# Altium project CRYO_ASIC_test_CTRL_panel.PrjPcb
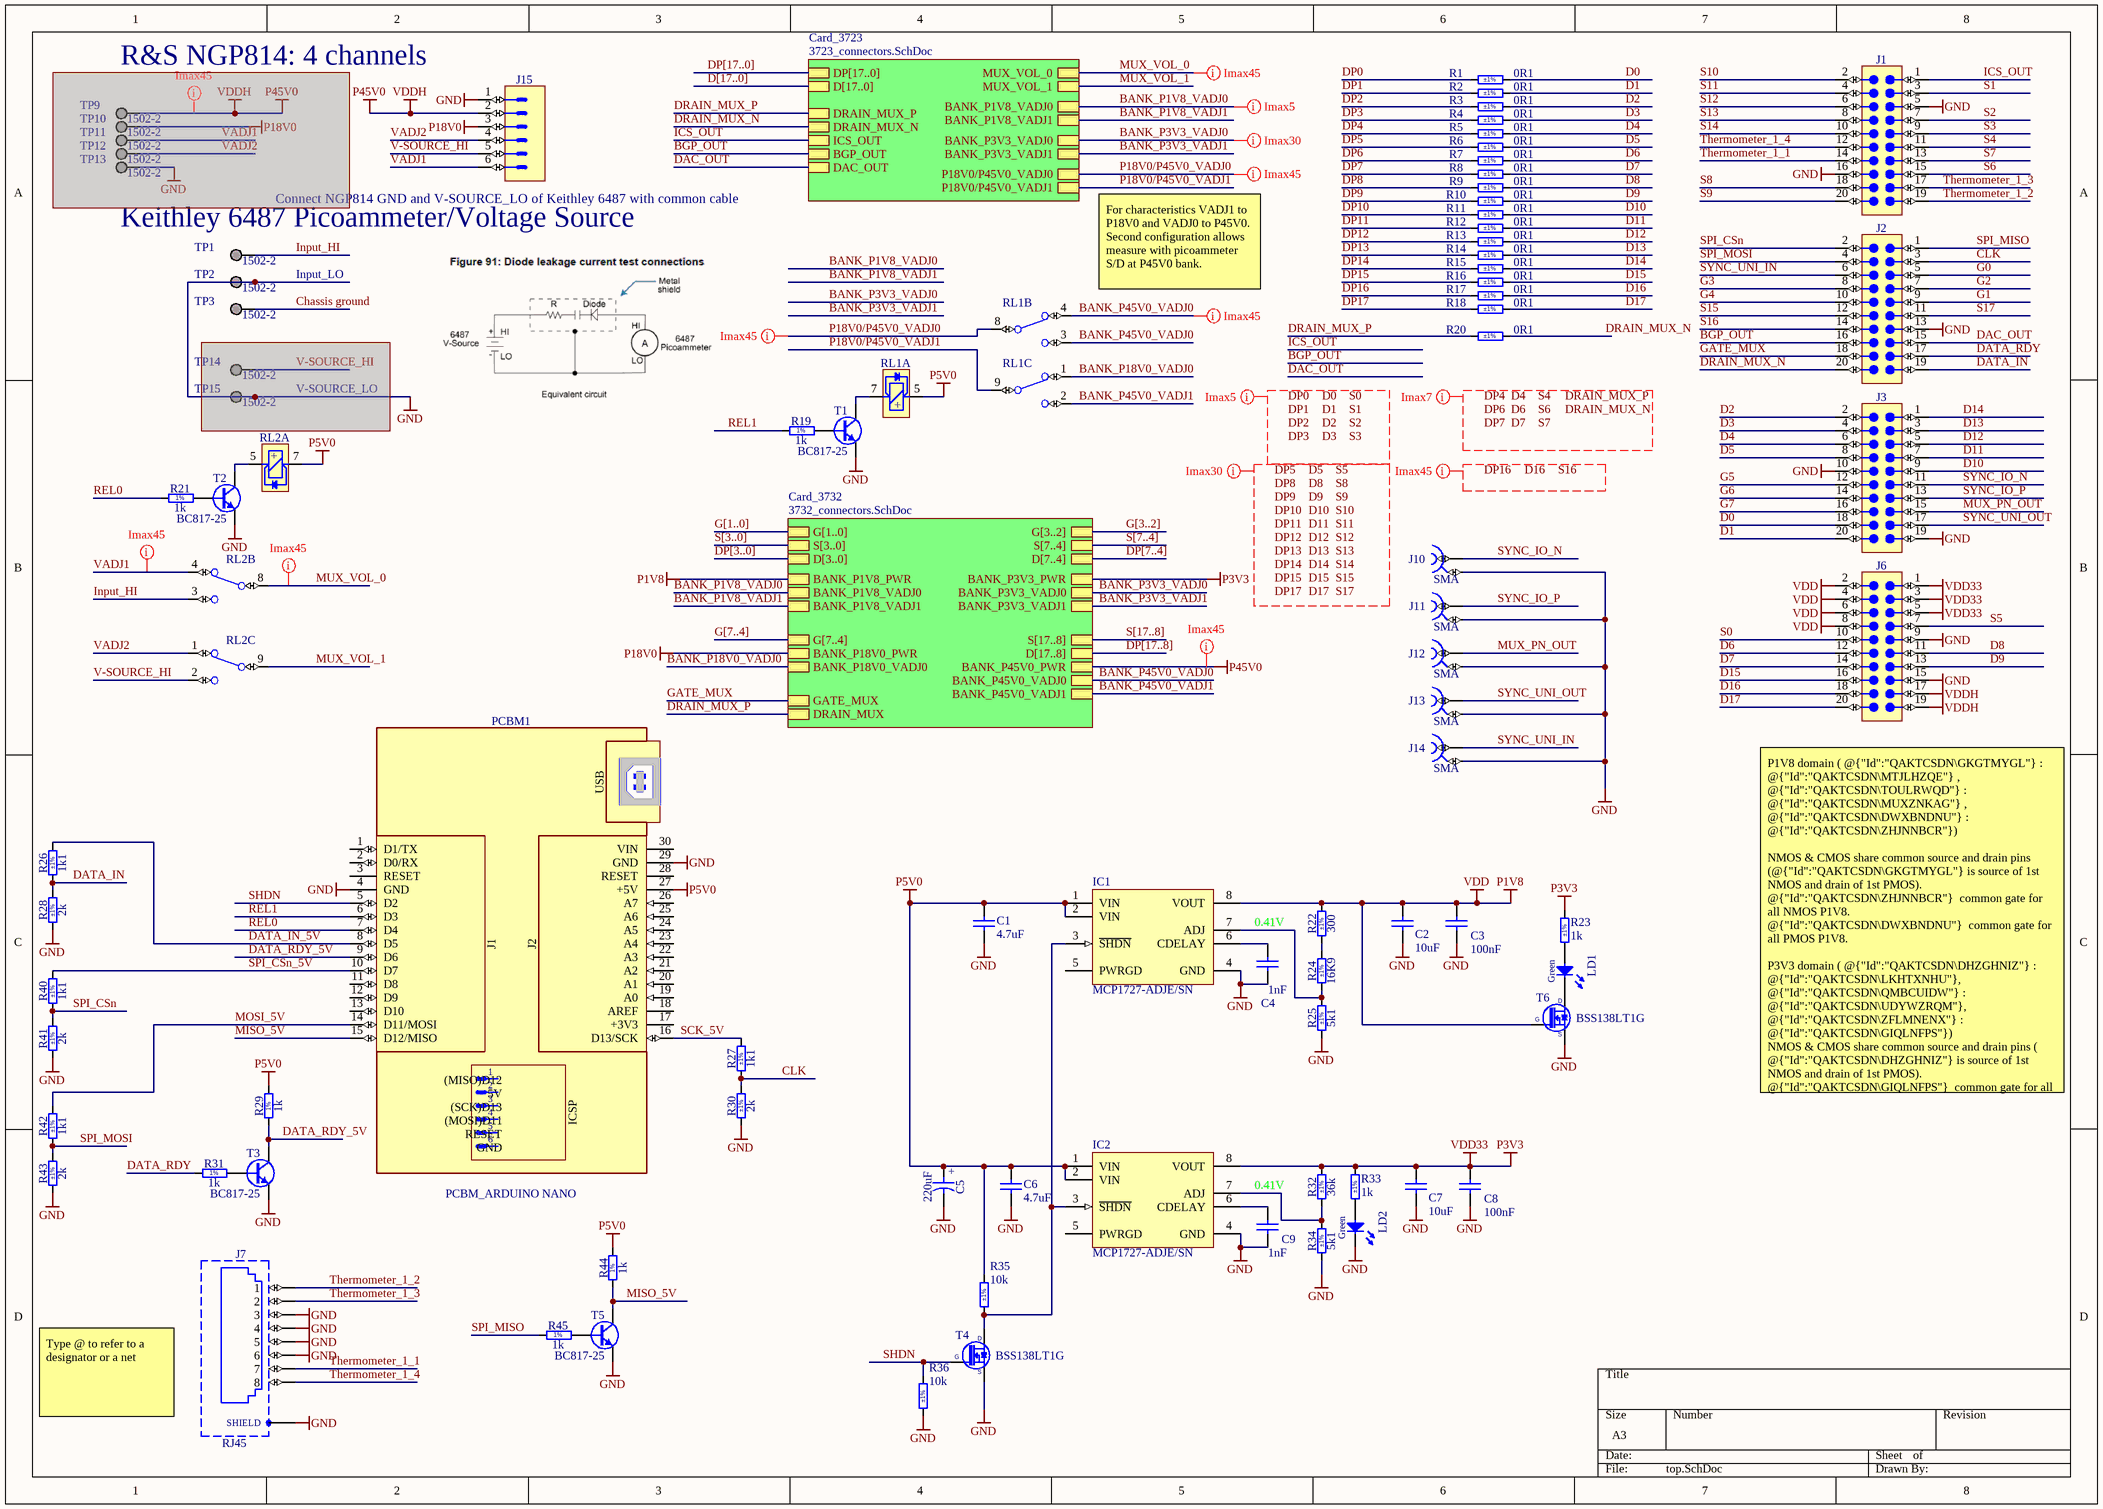
[diagram p0: top.SchDoc]
3 sheets, 97 parts. Net scope: hierarchical (ports join the sheet entries above them; power ports are global).
Board file: ctrl_panel.PcbDoc
Sheets:
  top.SchDoc
    Card_3732 = 3732_connectors.SchDoc
    Card_3723 = 3723_connectors.SchDoc

## Sheet top.SchDoc
size A3; SheetNumber: 1; SheetTotal: 3

### Parts
C1  4.7uF  [CAPC1005X55N]
C2  10uF  [CAPC1608X80N]
C3  100nF  [CAPC1005X55N]
C4  1nF  [CAPC1005X55N]
C5  220uF  [CAPMP7343X430N]
C6  4.7uF  [CAPC1005X55N]
C7  10uF  [CAPC1608X80N]
C8  100nF  [CAPC1005X55N]
C9  1nF  [CAPC1005X55N]
IC1  MCP1727-ADJE/SN  [SO-8]
IC2  MCP1727-ADJE/SN  [SO-8]
J1  Header 20  [3M_45220-600230]  (value not drawn)
J2  Header 20  [3M_45220-600230]  (value not drawn)
J3  Header 20  [3M_45220-600230]  (value not drawn)
J6  Header 20  [3M_45220-600230]  (value not drawn)
J7  RJ45  [TYCO_6368150-1]
J10  SMA  [SAMTEC_SMA-J-P-H-ST-TH1]
J11  SMA  [SAMTEC_SMA-J-P-H-ST-TH1]
J12  SMA  [SAMTEC_SMA-J-P-H-ST-TH1]
J13  SMA  [SAMTEC_SMA-J-P-H-ST-TH1]
J14  SMA  [SAMTEC_SMA-J-P-H-ST-TH1]
J15  Mini-Fit Jr.™  [MOLEX_39-30-0060]  (value not drawn)
LD1  Green  [LED_KINGBRIGHT_KP-1608CGCK]
LD2  Green  [LED_KINGBRIGHT_KP-1608CGCK]
PCBM1  PCBM_ARDUINO NANO  [PCBM_ARDUINO NANO_a]
R1  0R1  Tolerance: ±1%  [RESC1608X55N]
R2  0R1  Tolerance: ±1%  [RESC1608X55N]
R3  0R1  Tolerance: ±1%  [RESC1608X55N]
R4  0R1  Tolerance: ±1%  [RESC1608X55N]
R5  0R1  Tolerance: ±1%  [RESC1608X55N]
R6  0R1  Tolerance: ±1%  [RESC1608X55N]
R7  0R1  Tolerance: ±1%  [RESC1608X55N]
R8  0R1  Tolerance: ±1%  [RESC1608X55N]
R9  0R1  Tolerance: ±1%  [RESC1608X55N]
R10  0R1  Tolerance: ±1%  [RESC1608X55N]
R11  0R1  Tolerance: ±1%  [RESC1608X55N]
R12  0R1  Tolerance: ±1%  [RESC1608X55N]
R13  0R1  Tolerance: ±1%  [RESC1608X55N]
R14  0R1  Tolerance: ±1%  [RESC1608X55N]
R15  0R1  Tolerance: ±1%  [RESC1608X55N]
R16  0R1  Tolerance: ±1%  [RESC1608X55N]
R17  0R1  Tolerance: ±1%  [RESC1608X55N]
R18  0R1  Tolerance: ±1%  [RESC1608X55N]
R19  1k  [RESC1005X40N]
R20  0R1  Tolerance: ±1%  [RESC1608X55N]
R21  1k  [RESC1005X40N]
R22  300  Tolerance: ±1%  [RESC1005X40N]
R23  1k  Tolerance: ±1%  [RESC1005X40N]
R24  16K9  Tolerance: ±1%  [RESC1005X40N]
R25  5k1  Tolerance: ±1%  [RESC1005X40N]
R26  1k1  Tolerance: ±1%  [RESC1005X40N]
R27  1k1  Tolerance: ±1%  [RESC1005X40N]
R28  2k  Tolerance: ±1%  [RESC1005X40N]
R29  1k  [RESC1005X40N]
R30  2k  Tolerance: ±1%  [RESC1005X40N]
R31  1k  [RESC1005X40N]
R32  36k  Tolerance: ±1%  [RESC1005X40N]
R33  1k  Tolerance: ±1%  [RESC1005X40N]
R34  5k1  Tolerance: ±1%  [RESC1005X40N]
R35  10k  Tolerance: ±1%  [RESC1005X40N]
R36  10k  Tolerance: ±1%  [RESC1005X40N]
R40  1k1  Tolerance: ±1%  [RESC1005X40N]
R41  2k  Tolerance: ±1%  [RESC1005X40N]
R42  1k1  Tolerance: ±1%  [RESC1005X40N]
R43  2k  Tolerance: ±1%  [RESC1005X40N]
R44  1k  [RESC1005X40N]
R45  1k  [RESC1005X40N]
RL1  REL_PICKERING_107-2-C-5/3D  [REL_PICKERING_107-2-C]  (value not drawn)  (parts A,B,C of 3)
RL2  REL_PICKERING_107-2-C-5/3D  [REL_PICKERING_107-2-C]  (value not drawn)  (parts A,B,C of 3)
T1  BC817-25  [SOT95P230X110-3N]
T2  BC817-25  [SOT95P230X110-3N]
T3  BC817-25  [SOT95P230X110-3N]
T4  BSS138LT1G  [SOT95P240X110-3N]
T5  BC817-25  [SOT95P230X110-3N]
T6  BSS138LT1G  [SOT95P240X110-3N]
TP1  1502-2  [KSTN-1502-2]
TP2  1502-2  [KSTN-1502-2]
TP3  1502-2  [KSTN-1502-2]
TP9  1502-2  [KSTN-1502-2]  (masked out: inside a compile mask, not in the netlist)
TP10  1502-2  [KSTN-1502-2]  (masked out: inside a compile mask, not in the netlist)
TP11  1502-2  [KSTN-1502-2]  (masked out: inside a compile mask, not in the netlist)
TP12  1502-2  [KSTN-1502-2]  (masked out: inside a compile mask, not in the netlist)
TP13  1502-2  [KSTN-1502-2]  (masked out: inside a compile mask, not in the netlist)
TP14  1502-2  [KSTN-1502-2]  (masked out: inside a compile mask, not in the netlist)
TP15  1502-2  [KSTN-1502-2]  (masked out: inside a compile mask, not in the netlist)

### Sub-sheets
Card_3723 = 3723_connectors.SchDoc: D[17..0], DP[17..0], DRAIN_MUX_P, DRAIN_MUX_N, ICS_OUT, BGP_OUT, DAC_OUT, MUX_VOL_0, MUX_VOL_1, BANK_P1V8_VADJ0, BANK_P1V8_VADJ1, BANK_P3V3_VADJ0, BANK_P3V3_VADJ1, P18V0/P45V0_VADJ0, P18V0/P45V0_VADJ1
Card_3732 = 3732_connectors.SchDoc: G[1..0], S[3..0], D[3..0], BANK_P1V8_PWR, BANK_P1V8_VADJ0, BANK_P1V8_VADJ1, G[3..2], S[7..4], D[7..4], BANK_P3V3_PWR, BANK_P3V3_VADJ0, BANK_P3V3_VADJ1, G[7..4], BANK_P18V0_PWR, BANK_P18V0_VADJ0, S[17..8], D[17..8], BANK_P45V0_PWR, BANK_P45V0_VADJ0, GATE_MUX, DRAIN_MUX, BANK_P45V0_VADJ1

### Nets
GND: C1.1 C2.1 C3.1 C4.1 C5.2 C6.1 C7.1 C8.1 C9.1 IC1.4(GND) IC2.4(GND) J1.5 J1.16 J2.13 J3.10 J3.19 J6.9 J6.15 J7.3 J7.4 J7.5 J7.6 J7.SHIELD J10.2 J11.2 J12.2 J13.2 J14.2 J15.1 LD2.1(C) PCBM1.4(GND) PCBM1.29(GND) R25.1 R28.1 R30.1 R34.1 R36.2 R41.1 R43.1 T1.2(E) T2.2(E) T3.2(E) T4.2(S) T5.2(E) T6.2(S) TP2.1
P1V8: C2.2 C3.2 IC1.8(VOUT) J6.2 J6.4 J6.6 J6.8 R22.2 T6.1(G) ; sheet Card_3732/BANK_P1V8_PWR  [also labelled VDD]
P3V3: C7.2 C8.2 IC2.8(VOUT) J6.1 J6.3 J6.5 R23.2 R32.2 R33.2 ; sheet Card_3732/BANK_P3V3_PWR  [also labelled VDD33]
P5V0: C1.2 C5.1 C6.2 IC1.1(VIN) IC1.2(VIN) IC2.1(VIN) IC2.2(VIN) PCBM1.27(+5V) R29.2 R35.1 R44.2 RL1.5(COIL+) RL2.7(COIL-)
P18V0: J15.3 ; sheet Card_3732/BANK_P18V0_PWR
P45V0: J6.17 J6.19 J15.2 ; sheet Card_3732/BANK_P45V0_PWR  [also labelled VDDH]
BANK_P1V8_VADJ0: sheet Card_3732/BANK_P1V8_VADJ0, sheet Card_3723/BANK_P1V8_VADJ0
BANK_P1V8_VADJ1: sheet Card_3732/BANK_P1V8_VADJ1, sheet Card_3723/BANK_P1V8_VADJ1
BANK_P3V3_VADJ0: sheet Card_3732/BANK_P3V3_VADJ0, sheet Card_3723/BANK_P3V3_VADJ0
BANK_P3V3_VADJ1: sheet Card_3732/BANK_P3V3_VADJ1, sheet Card_3723/BANK_P3V3_VADJ1
BANK_P18V0_VADJ0: RL1.1(NC) ; sheet Card_3732/BANK_P18V0_VADJ0
BANK_P45V0_VADJ0: RL1.3(NO) RL1.4(NC) ; sheet Card_3732/BANK_P45V0_VADJ0
BANK_P45V0_VADJ1: RL1.2(NO) ; sheet Card_3732/BANK_P45V0_VADJ1
BGP_OUT: J2.16 ; sheet Card_3723/BGP_OUT
Chassis ground: TP3.1
CLK: J2.3 R27.1 R30.2
D0: J3.18 R1.2
D1: J3.20 R2.2
D2: J3.2 R3.2
D3: J3.4 R4.2
D4: J3.6 R5.2
D5: J3.8 R6.2
D6: J6.12 R7.2
D7: J6.14 R8.2
D8: J6.11 R9.2
D9: J6.13 R10.2
D10: J3.9 R11.2
D11: J3.7 R12.2
D12: J3.5 R13.2
D13: J3.3 R14.2
D14: J3.1 R15.2
D15: J6.16 R16.2
D16: J6.18 R17.2
D17: J6.20 R18.2
DAC_OUT: J2.15 ; sheet Card_3723/DAC_OUT
DATA_IN: J2.19 R26.1 R28.2
DATA_IN_5V: PCBM1.8(D5) R26.2
DATA_RDY: J2.17 R31.1
DATA_RDY_5V: PCBM1.9(D6) R29.1 T3.3(C)
DP0: R1.1
DP1: R2.1
DP2: R3.1
DP3: R4.1
DP4: R5.1
DP5: R6.1
DP6: R7.1
DP7: R8.1
DP8: R9.1
DP9: R10.1
DP10: R11.1
DP11: R12.1
DP12: R13.1
DP13: R14.1
DP14: R15.1
DP15: R16.1
DP16: R17.1
DP17: R18.1
DRAIN_MUX_N: J2.20 R20.2 ; sheet Card_3723/DRAIN_MUX_N
DRAIN_MUX_P: R20.1 ; sheet Card_3732/DRAIN_MUX, sheet Card_3723/DRAIN_MUX_P
G0: J2.5
G1: J2.9
G2: J2.7
G3: J2.8
G4: J2.10
G5: J3.12
G6: J3.14
G7: J3.16
GATE_MUX: J2.18 ; sheet Card_3732/GATE_MUX
ICS_OUT: J1.1 ; sheet Card_3723/ICS_OUT
Input_HI: RL2.3(NO) TP1.1
MISO_5V: PCBM1.15(D12/MISO) R44.1 T5.3(C)
MOSI_5V: PCBM1.14(D11/MOSI) R42.2
MUX_PN_OUT: J3.15 J12.1
MUX_VOL_0: RL2.8(C) ; sheet Card_3723/MUX_VOL_0
MUX_VOL_1: RL2.9(C) ; sheet Card_3723/MUX_VOL_1
P18V0/P45V0_VADJ0: RL1.8(C) ; sheet Card_3723/P18V0/P45V0_VADJ0
P18V0/P45V0_VADJ1: RL1.9(C) ; sheet Card_3723/P18V0/P45V0_VADJ1
REL0: PCBM1.7(D4) R21.1
REL1: PCBM1.6(D3) R19.1
S0: J6.10
S1: J1.3
S2: J1.7
S3: J1.9
S4: J1.11
S5: J6.7
S6: J1.15
S7: J1.13
S8: J1.18
S9: J1.20
S10: J1.2
S11: J1.4
S12: J1.6
S13: J1.8
S14: J1.10
S15: J2.12
S16: J2.14
S17: J2.11
SCK_5V: PCBM1.16(D13/SCK) R27.2
SHDN: PCBM1.5(D2) R36.1 T4.1(G)
SPI_CSn: J2.2 R40.1 R41.2
SPI_CSn_5V: PCBM1.10(D7) R40.2
SPI_MISO: J2.1 R45.1
SPI_MOSI: J2.4 R42.1 R43.2
SYNC_IO_N: J3.11 J10.1
SYNC_IO_P: J3.13 J11.1
SYNC_UNI_IN: J2.6 J14.1
SYNC_UNI_OUT: J3.17 J13.1
Thermometer_1_1: J1.14 J7.7
Thermometer_1_2: J1.19 J7.1
Thermometer_1_3: J1.17 J7.2
Thermometer_1_4: J1.12 J7.8
V-SOURCE_HI: J15.5 RL2.2(NO)
VADJ1: J15.6 RL2.4(NC)
VADJ2: J15.4 RL2.1(NC)
NetC4_2: C4.2 IC1.6(CDELAY)
NetC9_2: C9.2 IC2.6(CDELAY)
NetIC1_3: IC1.3(~{SHDN}) IC2.3(~{SHDN}) R35.2 T4.3(D)
NetIC1_7: IC1.7(ADJ) R24.1 R25.2
NetIC2_7: IC2.7(ADJ) R32.1 R34.2
NetLD1_1: LD1.1(C) T6.3(D)
NetLD1_2: LD1.2(A) R23.1
NetLD2_2: LD2.2(A) R33.1
NetR19_2: R19.2 T1.1(B)
NetR21_2: R21.2 T2.1(B)
NetR22_1: R22.1 R24.2
NetR31_2: R31.2 T3.1(B)
NetR45_2: R45.2 T5.1(B)
NetRL1_7: RL1.7(COIL-) T1.3(C)
NetRL2_5: RL2.5(COIL+) T2.3(C)

Not connected (* = marked no-connect by the designer): IC1 5(PWRGD); IC2 5(PWRGD); PCBM1 1(D1/TX) 2(D0/RX) 3(RESET) 11(D8) 12(D9) 13(D10) 17(+3V3) 18(AREF) 19(A0) 20(A1) 21(A2) 22(A3) 23(A4) 24(A5) 25(A6) 26(A7) 28(RESET) 30(VIN)

### Buses and harness runs
bus D[17..0] = sheet Card_3723/D[17..0]
bus DP[3..0] = sheet Card_3732/D[3..0]
bus DP[7..4] = sheet Card_3732/D[7..4]
bus DP[17..0] = sheet Card_3723/DP[17..0]
bus DP[17..8] = sheet Card_3732/D[17..8]
bus G[1..0] = sheet Card_3732/G[1..0]
bus G[3..2] = sheet Card_3732/G[3..2]
bus G[7..4] = sheet Card_3732/G[7..4]
bus S[3..0] = sheet Card_3732/S[3..0]
bus S[7..4] = sheet Card_3732/S[7..4]
bus S[17..8] = sheet Card_3732/S[17..8]

### Layout directives
net class Imax5: BANK_P1V8_VADJ0, D0, D1, D2, D3, DP0, DP1, DP2, DP3, S0, S1, S2, S3
net class Imax7: D4, D6, D7, DP4, DP6, DP7, DRAIN_MUX_N, DRAIN_MUX_P, S4, S6, S7
net class Imax30: BANK_P3V3_VADJ0, D5, D8, D9, D10, D11, D12, D13, D14, D15, D17, DP5, DP8, DP9, DP10, DP11, DP12, DP13, DP14, DP15, DP17, S5, S8, S9, S10, S11, S12, S13, S14, S15, S17
net class Imax45: (no net found under the mark), BANK_P45V0_VADJ0, D16, DP16, MUX_VOL_0, P18V0/P45V0_VADJ0, P45V0, S16, VADJ1

### Notes on the sheet
- R&S NGP814: 4 channels
- (near TP1) Keithley 6487 Picoammeter/Voltage Source
- (near J15) Connect NGP814 GND and V-SOURCE_LO of Keithley 6487 with common cable
- Input_LO
- For characteristics VADJ1 to P18V0 and VADJ0 to P45V0.
  Second configuration allows measure with picoammeter S/D at P45V0 bank.
- V-SOURCE_LO
- 0.41V
- (near J6) P1V8 domain ( @{"Id":"QAKTCSDN\GKGTMYGL"} : @{"Id":"QAKTCSDN\MTJLHZQE"} , @{"Id":"QAKTCSDN\TOULRWQD"} : @{"Id":"QAKTCSDN\MUXZNKAG"} , @{"Id":"QAKTCSDN\DWXBNDNU"} : @{"Id":"QAKTCSDN\ZHJNNBCR"})
  NMOS & CMOS share common source and drain pins (@{"Id":"QAKTCSDN\GKGTMYGL"} is source of 1st NMOS and drain of 1st PMOS).
  @{"Id":"QAKTCSDN\ZHJNNBCR"}  common gate for all NMOS P1V8.
  @{"Id":"QAKTCSDN\DWXBNDNU"}  common gate for all PMOS P1V8.
  P3V3 domain ( @{"Id":"QAKTCSDN\DHZGHNIZ"} : @{"Id":"QAKTCSDN\LKHTXNHU"}, @{"Id":"QAKTCSDN\QMBCUIDW"} : @{"Id":"QAKTCSDN\UDYWZRQM"}, @{"Id":"QAKTCSDN\ZFLMNENX"} : @{"Id":"QAKTCSDN\GIQLNFPS"})
  NMOS & CMOS share common source and drain pins ( @{"Id":"QAKTCSDN\DHZGHNIZ"} is source of 1st NMOS and drain of 1st PMOS).
  @{"Id":"QAKTCSDN\GIQLNFPS"}  common gate for all NMOS P3V3.
  @{"Id":"QAKTCSDN\ZFLMNENX"}  common gate for all PMOS P1V8.
  P18V0 domain ( @{"Id":"QAKTCSDN\TCQKZZJW"} : @{"Id":"QAKTCSDN\IFVMLPFB"})
  Gates for CMOS in P45V0 domain.
  @{"Id":"QAKTCSDN\TCQKZZJW"}  Gate for first 5 NMOS
  @{"Id":"QAKTCSDN\BTYXEQQY"}  Gate for second 5 NMOS
  @{"Id":"QAKTCSDN\BTVZBPLE"}  Gate for first 5 PMOS
  @{"Id":"QAKTCSDN\IFVMLPFB"}  Gate for second 5 PMOS
  P45V0 domain ( @{"Id":"QAKTCSDN\KKAFSXUZ"} : @{"Id":"QAKTCSDN\VMRQOTMS"}, @{"Id":"QAKTCSDN\EVYYKNRE"} : @{"Id":"QAKTCSDN\AUFCYRPE"})
  Sources and drains for cmos:
  8-12: NMOS, 2 transistors per pin (different gate)
  13-17: PMOS, 2 transistors per pin (different gate)
- Type @ to refer to a designator or a net
- Labels drawn without touching a wire or pin: D0, D1, D2, D3, D4, D5, D6, D7, D8, D9, D10, D11, D12, D13, D14, D15, D16, D17, DP0, DP1, DP2, DP3, DP4, DP5, DP6, DP7, DP8, DP9, DP10, DP11, DP12, DP13, DP14, DP15, DP16, DP17, DRAIN_MUX_N, DRAIN_MUX_P, S0, S1, S2, S3, S4, S5, S6, S7, S8, S9, S10, S11, S12, S13, S14, S15, S16, S17
- (in symbol CTE7343-43_220UF_16V_10%) +
- (in symbol PCBM_ARDUINO NANO_a) USB; J1; J2; (MISO)D12; 5V; (SCK)D13; ICSP; (MOSI)D11
- (in symbol R0402_1K_1%_0.0625W_100PPM) 1%
- (in symbol REL_PICKERING_107-2-C-5/3D, part A) +

### Library data of the parts
C1 C6 = CC0402_4.7UF_10V_10%_X5R: Non-polarised capacitor; Part Description: SMD Multilayer Chip Ceramic Capacitor; Manufacturer: GENERIC; Manufacturer1 Part Number: C1005X5R1A475K050; Voltage: 10V; TC: X5R; Tolerance: ±10%; Value: 4.7uF; Part Number: CC0402_4.7UF_10V_10%_X5R; Component Kind: Standard; Component Type: Standard; Pin Count: 2; Status: Preferred; Manufacturer Part Number: CC0402_4.7UF_10V_10%_X5R; Case: 0402; Mounted: Yes; Socket: No; SMD: Yes; Sense: No; Manufacturer1 Example: TDK; Manufacturer1 ComponentHeight: 0.65mm; HelpURL: \\cern.ch\dfs\Applications\Altium\Datasheets\CC0402_X5R_TDK_C.pdf; Author: CERN DEM BC; CreateDate: 10.01.2020; LatestRevisionDate: 10.01.2020
C2 C7 = CC0603_10UF_10V_10%_X5R: Non-polarised capacitor; Part Description: SMD Multilayer Chip Ceramic Capacitor; Manufacturer: GENERIC; Manufacturer1 Part Number: GRM188R61A106KE69D; Voltage: 10V; TC: X5R; Tolerance: ±10%; Value: 10uF; Part Number: CC0603_10UF_10V_10%_X5R; Component Kind: Standard; Component Type: Standard; Pin Count: 2; Status: None; Manufacturer Part Number: CC0603_10UF_10V_10%_X5R; Case: 0603; Mounted: Yes; Socket: No; SMD: Yes; Sense: No; Manufacturer1 Example: MURATA; Manufacturer1 ComponentHeight: 0.8mm; HelpURL: \\cern.ch\dfs\Applications\Altium\Datasheets\CC0603_MURATA_GRM188R61A106KE69D.pdf; Author: CERN DEM JLC; CreateDate: 31.01.2017; LatestRevisionDate: 31.01.2017
C3 C8 = CC0402_100NF_16V_10%_X5R: Non-polarised capacitor; Part Description: SMD Multilayer Chip Ceramic Capacitor; Manufacturer: GENERIC; Manufacturer1 Part Number: GRM155R61C104KA88D; Voltage: 16V; TC: X5R; Tolerance: ±10%; Value: 100nF; Part Number: CC0402_100NF_16V_10%_X5R; Component Kind: Standard; Component Type: Standard; Pin Count: 2; Status: None; Manufacturer Part Number: CC0402_100NF_16V_10%_X5R; Case: 0402; Mounted: Yes; Socket: No; SMD: Yes; Sense: No; Manufacturer1 Example: MURATA; Manufacturer1 ComponentHeight: 0.55mm; HelpURL: \\cern.ch\dfs\Applications\Altium\Datasheets\CC0402_X5R_MURATA_GRM.pdf; Author: CERN DEM JLC; CreateDate: 10.12.2013; LatestRevisionDate: 10.12.2013
C4 C9 = CC0402_1NF_50V_5%_C0G: Non-polarised capacitor; Part Description: SMD Multilayer Chip Ceramic Capacitor; Manufacturer: GENERIC; Manufacturer1 Part Number: C0402C102J5GACTU; Voltage: 50V; TC: C0G/NP0; Tolerance: ±5%; Value: 1nF; Part Number: CC0402_1NF_50V_5%_C0G; Component Kind: Standard; Component Type: Standard; Pin Count: 2; Status: Preferred; Manufacturer Part Number: CC0402_1NF_50V_5%_C0G; Case: 0402; Mounted: Yes; Socket: No; SMD: Yes; Sense: No; Manufacturer1 Example: KEMET; Manufacturer1 ComponentHeight: 0.55mm; HelpURL: \\cern.ch\dfs\Applications\Altium\Datasheets\CC0402_C0G_KEMET_(Commercial Grade).pdf; Author: CERN DEM BC; CreateDate: 02.09.2019; LatestRevisionDate: 02.09.2019
C5 = CTE7343-43_220UF_16V_10%: Polarised capacitor; Part Description: Solid Tantalum Chip Capacitor; Manufacturer: GENERIC; Manufacturer1 Part Number: TAJE227K016R; Voltage: 16V; Tolerance: ±10%; Part Number: CTE7343-43_220UF_16V_10%; Component Kind: Standard; Component Type: Standard; Pin Count: 2; Value: 220uF; Status: Preferred; Manufacturer Part Number: CTE7343-43_220UF_16V_10%; Case: E; Mounted: Yes; Socket: No; SMD: Yes; Sense: No; Manufacturer1 Example: AVX; Manufacturer1 ComponentHeight: 4.3mm; HelpURL: \\cern.ch\dfs\Applications\Altium\Datasheets\CTE_AVX_TAJ.pdf; Author: CERN DEM JLC; CreateDate: 03.12.2007; LatestRevisionDate: 03.12.2007
IC1 IC2 = MCP1727-ADJE/SN: 1.5A, Low Voltage, Low Quiescent Current LDO Regulator, 8-Pin SOIC 150mil, Extended Temperature; Value: MCP1726-ADJE/SN; Published: 29-Jan-2009; DatasheetVersion: revB, Feb-2007; PackageVersion: revAW, Oct-2008; PackageReference: SOIC-SN8; Publisher: Altium Limited; PackageDescription: 8-Lead Plastic Small Outline (SN) - Narrow, 3.90mm Body [SOIC]; Code_JEDEC: MS-012; Code_IPC: SOIC127P600-8; ComponentLink1Description: Manufacturer Link; ComponentLink1URL: http://www.microchip.com; ComponentLink2Description: Datasheet; ComponentLink2URL: http://ww1.microchip.com/downloads/en/DeviceDoc/21999b.pdf; ComponentLink3Description: Packaging Specification; ComponentLink3URL: http://ww1.microchip.com/downloads/en/PackagingSpec/00049AW.pdf
J1-J3 J6 = 3M_45220-600230: Connector 20 Male; Part Description: 20 Contacts - 1.27mm (0.050") Pitch - Shrouded Boardmount Vertical Header Without Latch/Ejectors, 452 Series; Manufacturer: 3M; PressFit: No; Part Number: 3M_45220-600230; Component Kind: Standard; Component Type: Standard; Pin Count: 20; Family: Header 20; Mounted: Yes; Socket: No; SMD: No; Sense: No; Status: None; Manufacturer Part Number: 45220-600230; ComponentHeight: 5.64mm; HelpURL: \\cern.ch\dfs\Applications\Altium\Datasheets\3M_45220-600230.pdf; Author: CERN DEM MR; CreateDate: 15.08.2019; LatestRevisionDate: 15.08.2019
J7 = TYCO_6368150-1: Connector RJ45 + Shield; Part Description: 1 Port, RJ45 Connector,  8 Positions, Shielded, Straight, Category 5; Manufacturer: TYCO ELECTRONICS; PressFit: No; Part Number: TYCO_6368150-1; Component Kind: Standard; Component Type: Standard; Pin Count: 10; Family: RJ45; Mounted: Yes; Socket: No; SMD: No; Sense: No; Status: None; Manufacturer Part Number: 6368150-1; ComponentHeight: 17.02mm; HelpURL: \\cern.ch\dfs\Applications\Altium\Datasheets\TYCO_6368150-1.pdf; Author: CERN DEM MR; CreateDate: 18.06.2019; LatestRevisionDate: 18.06.2019
J10-J14 = SAMTEC_SMA-J-P-H-ST-TH1: Part Description: 50 Ohm SMA Straight Through-hole PCB Jack; Manufacturer: SAMTEC; PressFit: No; Part Number: SAMTEC_SMA-J-P-H-ST-TH1; Component Kind: Standard; Component Type: Standard; Pin Count: 5; Family: SMA; Mounted: Yes; Socket: No; SMD: No; Sense: No; Status: None; Manufacturer Part Number: SMA-J-P-H-ST-TH1; ComponentHeight: 9.55mm; HelpURL: \\cern.ch\dfs\Applications\Altium\Datasheets\SAMTEC_SMA-J-P-H-ST-TH1.pdf; Author: CERN DEM BC; CreateDate: 11.01.2021; LatestRevisionDate: 11.01.2021
J15 = MOLEX_39-30-0060: Connector 6 Male; Part Description: 4.20mm (.165") Pitch Mini-Fit Jr. Header, Dual Row, Right Angle with Snap-in Plastic Peg PCB Lock, 6 Circuits; Manufacturer: MOLEX; PressFit: No; Part Number: MOLEX_39-30-0060; Component Kind: Standard; Component Type: Standard; Pin Count: 6; Family: Mini-Fit Jr.™; Mounted: Yes; Socket: No; SMD: No; Sense: No; Status: None; Manufacturer Part Number: 39-30-0060; ComponentHeight: 11.4mm; HelpURL: \\cern.ch\dfs\Applications\Altium\Datasheets\MOLEX_39-30-0060.pdf; Author: CERN DEM JMW; CreateDate: 22.06.2017; LatestRevisionDate: 22.06.2017
LD1 LD2 = LED_KINGBRIGHT_KP-1608CGCK: LED Green 1C 2A; Part Description: 1.6x0.8mm SMD Chip Green LED Lamp; PressFit: No; Bonding: No; Part Number: LED_KINGBRIGHT_KP-1608CGCK; Component Kind: Standard; Component Type: Standard; Color: Green; PackageDescription: SMT Green LED, Case 0603, Body L 1.60mm x W 0.80mm x H 1.10mm; Manufacturer: KINGBRIGHT; Manufacturer Part Number: KP-1608CGCK; Pin Count: 2; Case: 0603; Mounted: Yes; Socket: No; SMD: Yes; Sense: No; ComponentHeight: 1.1mm; HelpURL: \\cern.ch\dfs\Applications\Altium\Datasheets\LED_KINGBRIGHT_KP-1608CGCK.pdf; Author: CERN DEM HF; CreateDate: 01.10.2021; LatestRevisionDate: 01.10.2021
PCBM1 = PCBM_ARDUINO NANO_a: Arduino NANO Printed Circuit Board Module; PressFit: No; Sense Comment: Non-washable; Bonding: No; Part Number: PCBM_ARDUINO NANO_a; Component Kind: Standard; Component Type: Standard; Device: PCBM_ARDUINO NANO; PackageDescription: Microcontroller Board Arduino NANO; Part Description: Arduino NANO Printed Circuit Board Module; Manufacturer: ARDUINO; Manufacturer Part Number: ARDUINO NANO; Pin Count: 0; Mounted: Yes; Socket: No; SMD: No; Sense: Yes; ComponentHeight: 12.6mm; Author: CERN DEM HF; HelpURL: \\cern.ch\dfs\Applications\Altium\Datasheets\PCBM_ARDUINO NANO.pdf; CreateDate: 05.10.2022; LatestRevisionDate: 05.10.2022
R1-R18 R20 = R0603_0R1_1%_0.1W_200PPM: Resistor - 1%; Part Description: Low Value Chip Resistor; Manufacturer: GENERIC; Manufacturer1 Part Number: CRL0603-FW-R100ELF; Power: 0.1W; TC: ±200ppm/°C; PressFit: No; Part Number: R0603_0R1_1%_0.1W_200PPM; Component Kind: Standard; Component Type: Standard; Pin Count: 2; Value: 0R1; Status: Preferred; Manufacturer Part Number: R0603_0R1_1%_0.1W_200PPM; Case: 0603; Mounted: Yes; Sense: No; Socket: No; SMD: Yes; Manufacturer1 Example: BOURNS; Manufacturer1 ComponentHeight: 0.55mm; HelpURL: \\cern.ch\dfs\Applications\Altium\Datasheets\R0603_BOURNS_CRL.pdf; Author: CERN DEM JMW; CreateDate: 26.11.2019; LatestRevisionDate: 26.11.2019
R19 R21 R23 R29 R31 R33 R44 R45 = R0402_1K_1%_0.0625W_100PPM: Resistor - 1%; Part Description: General Purpose Thick Film Chip Resistor; Manufacturer: GENERIC; Manufacturer1 Part Number: 232270671002L; TC: ±100ppm/°C; PressFit: No; Part Number: R0402_1K_1%_0.0625W_100PPM; Component Kind: Standard; Component Type: Standard; Pin Count: 2; Value: 1k; Status: Not Recommended; Power: 0.0625W; Manufacturer Part Number: R0402_1K_1%_0.0625W_100PPM; Case: 0402; Mounted: Yes; Sense: No; Socket: No; SMD: Yes; Manufacturer1 Example: YAGEO PHYCOMP; Manufacturer1 ComponentHeight: 0.4mm; HelpURL: \\cern.ch\dfs\Applications\Altium\Datasheets\R0402_Phycomp_RC0402.pdf; Author: CERN DEM JLC; CreateDate: 03.12.2007; LatestRevisionDate: 17.10.2012
  R19 R21 R29 R31 R44 R45: Tolerance: ±1%
R22 = R0402_300R_1%_0.0625W_100PPM: Resistor - 1%; Part Description: General Purpose Thick Film Chip Resistor; Manufacturer: GENERIC; Manufacturer1 Part Number: 232270673001L; TC: ±100ppm/°C; PressFit: No; Part Number: R0402_300R_1%_0.0625W_100PPM; Component Kind: Standard; Component Type: Standard; Pin Count: 2; Value: 300; Status: Not Recommended; Power: 0.0625W; Manufacturer Part Number: R0402_300R_1%_0.0625W_100PPM; Case: 0402; Mounted: Yes; Sense: No; Socket: No; SMD: Yes; Manufacturer1 Example: YAGEO PHYCOMP; Manufacturer1 ComponentHeight: 0.4mm; HelpURL: \\cern.ch\dfs\Applications\Altium\Datasheets\R0402_Phycomp_RC0402.pdf; Author: CERN DEM JLC; CreateDate: 03.12.2007; LatestRevisionDate: 17.10.2012
R24 = R0402_16K9_1%_0.063W_100PPM: Resistor - 1%; Part Description: General Purpose Thick Film Chip Resistor; Manufacturer: GENERIC; Manufacturer1 Part Number: CRCW040216K9FK; Power: 0.063W; TC: ±100ppm/°C; PressFit: No; Part Number: R0402_16K9_1%_0.063W_100PPM; Component Kind: Standard; Component Type: Standard; Pin Count: 2; Value: 16K9; Status: None; Manufacturer Part Number: R0402_16K9_1%_0.063W_100PPM; Case: 0402; Mounted: Yes; Sense: No; Socket: No; SMD: Yes; Manufacturer1 Example: VISHAY; Manufacturer1 ComponentHeight: 0.4mm; HelpURL: \\cern.ch\dfs\Applications\Altium\Datasheets\R0402_VISHAY_CRCW e3.pdf; Author: CERN DEM BC; CreateDate: 10.01.2020; LatestRevisionDate: 10.01.2020
R25 R34 = R0402_5K1_1%_0.0625W_100PPM: Resistor - 1%; Part Description: General Purpose Thick Film Chip Resistor; Manufacturer: GENERIC; Manufacturer1 Part Number: 232270675102L; TC: ±100ppm/°C; PressFit: No; Part Number: R0402_5K1_1%_0.0625W_100PPM; Component Kind: Standard; Component Type: Standard; Pin Count: 2; Value: 5k1; Status: Not Recommended; Power: 0.0625W; Manufacturer Part Number: R0402_5K1_1%_0.0625W_100PPM; Case: 0402; Mounted: Yes; Sense: No; Socket: No; SMD: Yes; Manufacturer1 Example: YAGEO PHYCOMP; Manufacturer1 ComponentHeight: 0.4mm; HelpURL: \\cern.ch\dfs\Applications\Altium\Datasheets\R0402_Phycomp_RC0402.pdf; Author: CERN DEM JLC; CreateDate: 03.12.2007; LatestRevisionDate: 17.10.2012
R26 R27 R40 R42 = R0402_1K1_1%_0.0625W_100PPM: Resistor - 1%; Part Description: General Purpose Thick Film Chip Resistor; Manufacturer: GENERIC; Manufacturer1 Part Number: 232270671102L; TC: ±100ppm/°C; PressFit: No; Part Number: R0402_1K1_1%_0.0625W_100PPM; Component Kind: Standard; Component Type: Standard; Pin Count: 2; Value: 1k1; Status: Not Recommended; Power: 0.0625W; Manufacturer Part Number: R0402_1K1_1%_0.0625W_100PPM; Case: 0402; Mounted: Yes; Sense: No; Socket: No; SMD: Yes; Manufacturer1 Example: YAGEO PHYCOMP; Manufacturer1 ComponentHeight: 0.4mm; HelpURL: \\cern.ch\dfs\Applications\Altium\Datasheets\R0402_Phycomp_RC0402.pdf; Author: CERN DEM JLC; CreateDate: 03.12.2007; LatestRevisionDate: 17.10.2012
R28 R30 R41 R43 = R0402_2K_1%_0.0625W_100PPM: Resistor - 1%; Part Description: General Purpose Thick Film Chip Resistor; Manufacturer: GENERIC; Manufacturer1 Part Number: 232270672002L; TC: ±100ppm/°C; PressFit: No; Part Number: R0402_2K_1%_0.0625W_100PPM; Component Kind: Standard; Component Type: Standard; Pin Count: 2; Value: 2k; Status: Not Recommended; Power: 0.0625W; Manufacturer Part Number: R0402_2K_1%_0.0625W_100PPM; Case: 0402; Mounted: Yes; Sense: No; Socket: No; SMD: Yes; Manufacturer1 Example: YAGEO PHYCOMP; Manufacturer1 ComponentHeight: 0.4mm; HelpURL: \\cern.ch\dfs\Applications\Altium\Datasheets\R0402_Phycomp_RC0402.pdf; Author: CERN DEM JLC; CreateDate: 03.12.2007; LatestRevisionDate: 17.10.2012
R32 = R0402_36K_1%_0.0625W_100PPM: Resistor - 1%; Part Description: General Purpose Thick Film Chip Resistor; Manufacturer: GENERIC; Manufacturer1 Part Number: 232270673603L; TC: ±100ppm/°C; PressFit: No; Part Number: R0402_36K_1%_0.0625W_100PPM; Component Kind: Standard; Component Type: Standard; Pin Count: 2; Value: 36k; Status: Not Recommended; Power: 0.0625W; Manufacturer Part Number: R0402_36K_1%_0.0625W_100PPM; Case: 0402; Mounted: Yes; Sense: No; Socket: No; SMD: Yes; Manufacturer1 Example: YAGEO PHYCOMP; Manufacturer1 ComponentHeight: 0.4mm; HelpURL: \\cern.ch\dfs\Applications\Altium\Datasheets\R0402_Phycomp_RC0402.pdf; Author: CERN DEM JLC; CreateDate: 03.12.2007; LatestRevisionDate: 17.10.2012
R35 R36 = R0402_10K_1%_0.0625W_100PPM: Resistor - 1%; Part Description: General Purpose Thick Film Chip Resistor; Manufacturer: GENERIC; Manufacturer1 Part Number: 232270671003L; TC: ±100ppm/°C; PressFit: No; Value: 10k; Part Number: R0402_10K_1%_0.0625W_100PPM; Component Kind: Standard; Component Type: Standard; Pin Count: 2; Status: Not Recommended; Power: 0.0625W; Manufacturer Part Number: R0402_10K_1%_0.0625W_100PPM; Case: 0402; Mounted: Yes; Sense: No; Socket: No; SMD: Yes; Manufacturer1 Example: YAGEO PHYCOMP; Manufacturer1 ComponentHeight: 0.4mm; HelpURL: \\cern.ch\dfs\Applications\Altium\Datasheets\R0402_Phycomp_RC0402.pdf; Author: CERN DEM JLC; CreateDate: 03.12.2007; LatestRevisionDate: 17.10.2012
RL1 RL2 = REL_PICKERING_107-2-C-5/3D: DPDT (2 Form C) Reed Relay,  For Stacking On 0.2Inches Pitch, 107 Serie; Part Description: 0.25A/200VDC, DPDT (2 Form C) Reed Relay,  For Stacking On 0.2 Inches Pitch, 107 Series; Manufacturer: PICKERING ELECTRONICS; PressFit: No; Value: 5VDC; Part Number: REL_PICKERING_107-2-C-5/3D; Component Kind: Standard; Component Type: Standard; Pin Count: 8; PackageDescription: 8 Leads, Body 24.1 x 4.8mm, 2 Form C Mini-SIL Reed Relay 107 Series; Mounted: Yes; Socket: No; SMD: No; Sense: No; Status: None; Manufacturer Part Number: 107-2-C-5/3D; ComponentHeight: 10.2mm; HelpURL: \\cern.ch\dfs\Applications\Altium\Datasheets\REL_PICKERING_107.pdf; Author: CERN DEM JLC; CreateDate: 31.05.2011; LatestRevisionDate: 31.05.2011
T1-T3 T5 = BC817-25: NPN Transistor; Part Description: 45V 500mA NPN General-Purpose Transistor; Manufacturer: NXP SEMICONDUCTORS; PressFit: No; Bonding: No; Part Number: BC817-25; Component Kind: Standard; Component Type: Standard; Device: BC817-25; PackageDescription: SOT23, 3 pin, Pitch 0.95mm - 1.3mm W X 2.9mm L X 1.1mm H, IPC Medium Density; Manufacturer Part Number: BC817-25; Pin Count: 3; Case: SOT23-3; Mounted: Yes; Socket: No; SMD: Yes; Sense: No; ComponentHeight: 1.1mm; HelpURL: \\cern.ch\dfs\Applications\Altium\Datasheets\BC817-25.pdf; Author: CERN DEM JLC; CreateDate: 28.10.2014; LatestRevisionDate: 28.10.2014
T4 T6 = BSS138LT1G: N-CHANNEL MOSFET WITH DIODE; Part Description: 50V, 200mA N-Channel Enhancement Mode Field-Effect Transistor; Manufacturer: ON SEMICONDUCTOR; PressFit: No; Bonding: No; Part Number: BSS138LT1G; Component Kind: Standard; Component Type: Standard; Device: BSS138LT1G; PackageDescription: SOT23, 0.95mm Pitch; 3 Pin, 1.40mm W X 3.00mm L X 1.10mm H body, IPC Medium Density; Manufacturer Part Number: BSS138LT1G; Pin Count: 3; Case: SOT23-3; Mounted: Yes; Socket: No; SMD: Yes; Sense: No; ComponentHeight: 1.11mm; HelpURL: \\cern.ch\dfs\Applications\Altium\Datasheets\BSS138LT1G.pdf; Author: CERN DEM JLC; CreateDate: 23.03.2009; LatestRevisionDate: 23.03.2009
TP1-TP3 TP9-TP15 = CMP-1672-00001-5: Terminal DBL Turret, Through Hole, RoHS; Manufacturer: Keystone; ComponentLink1URL: http://www.keyelco.com/; ComponentLink2Description: Datasheet; Length: 2.77 mm; Mount: Through Hole; PackageDescription: 1-Pin Through Hole Device, Dia 3.18 mm; Lead Pitch: 0.218 inch; DatasheetVersion: Rev. A, 02/2008; PackageReference: 1502-2; ComponentLink2URL: http://www.keyelco.com/product-pdf.cfm?p=3293; ComponentLink1Description: Manufacturer URL; Mounting Technology: Through Hole; Package Quantity: 1; Pins: 50; REACH SVHC: No SVHC; Contact Finish: Tin; Contact Material: Brass; RoHSCompliant: true

## Sheet 3732_connectors.SchDoc
size A3; SheetNumber: 3; SheetTotal: 3
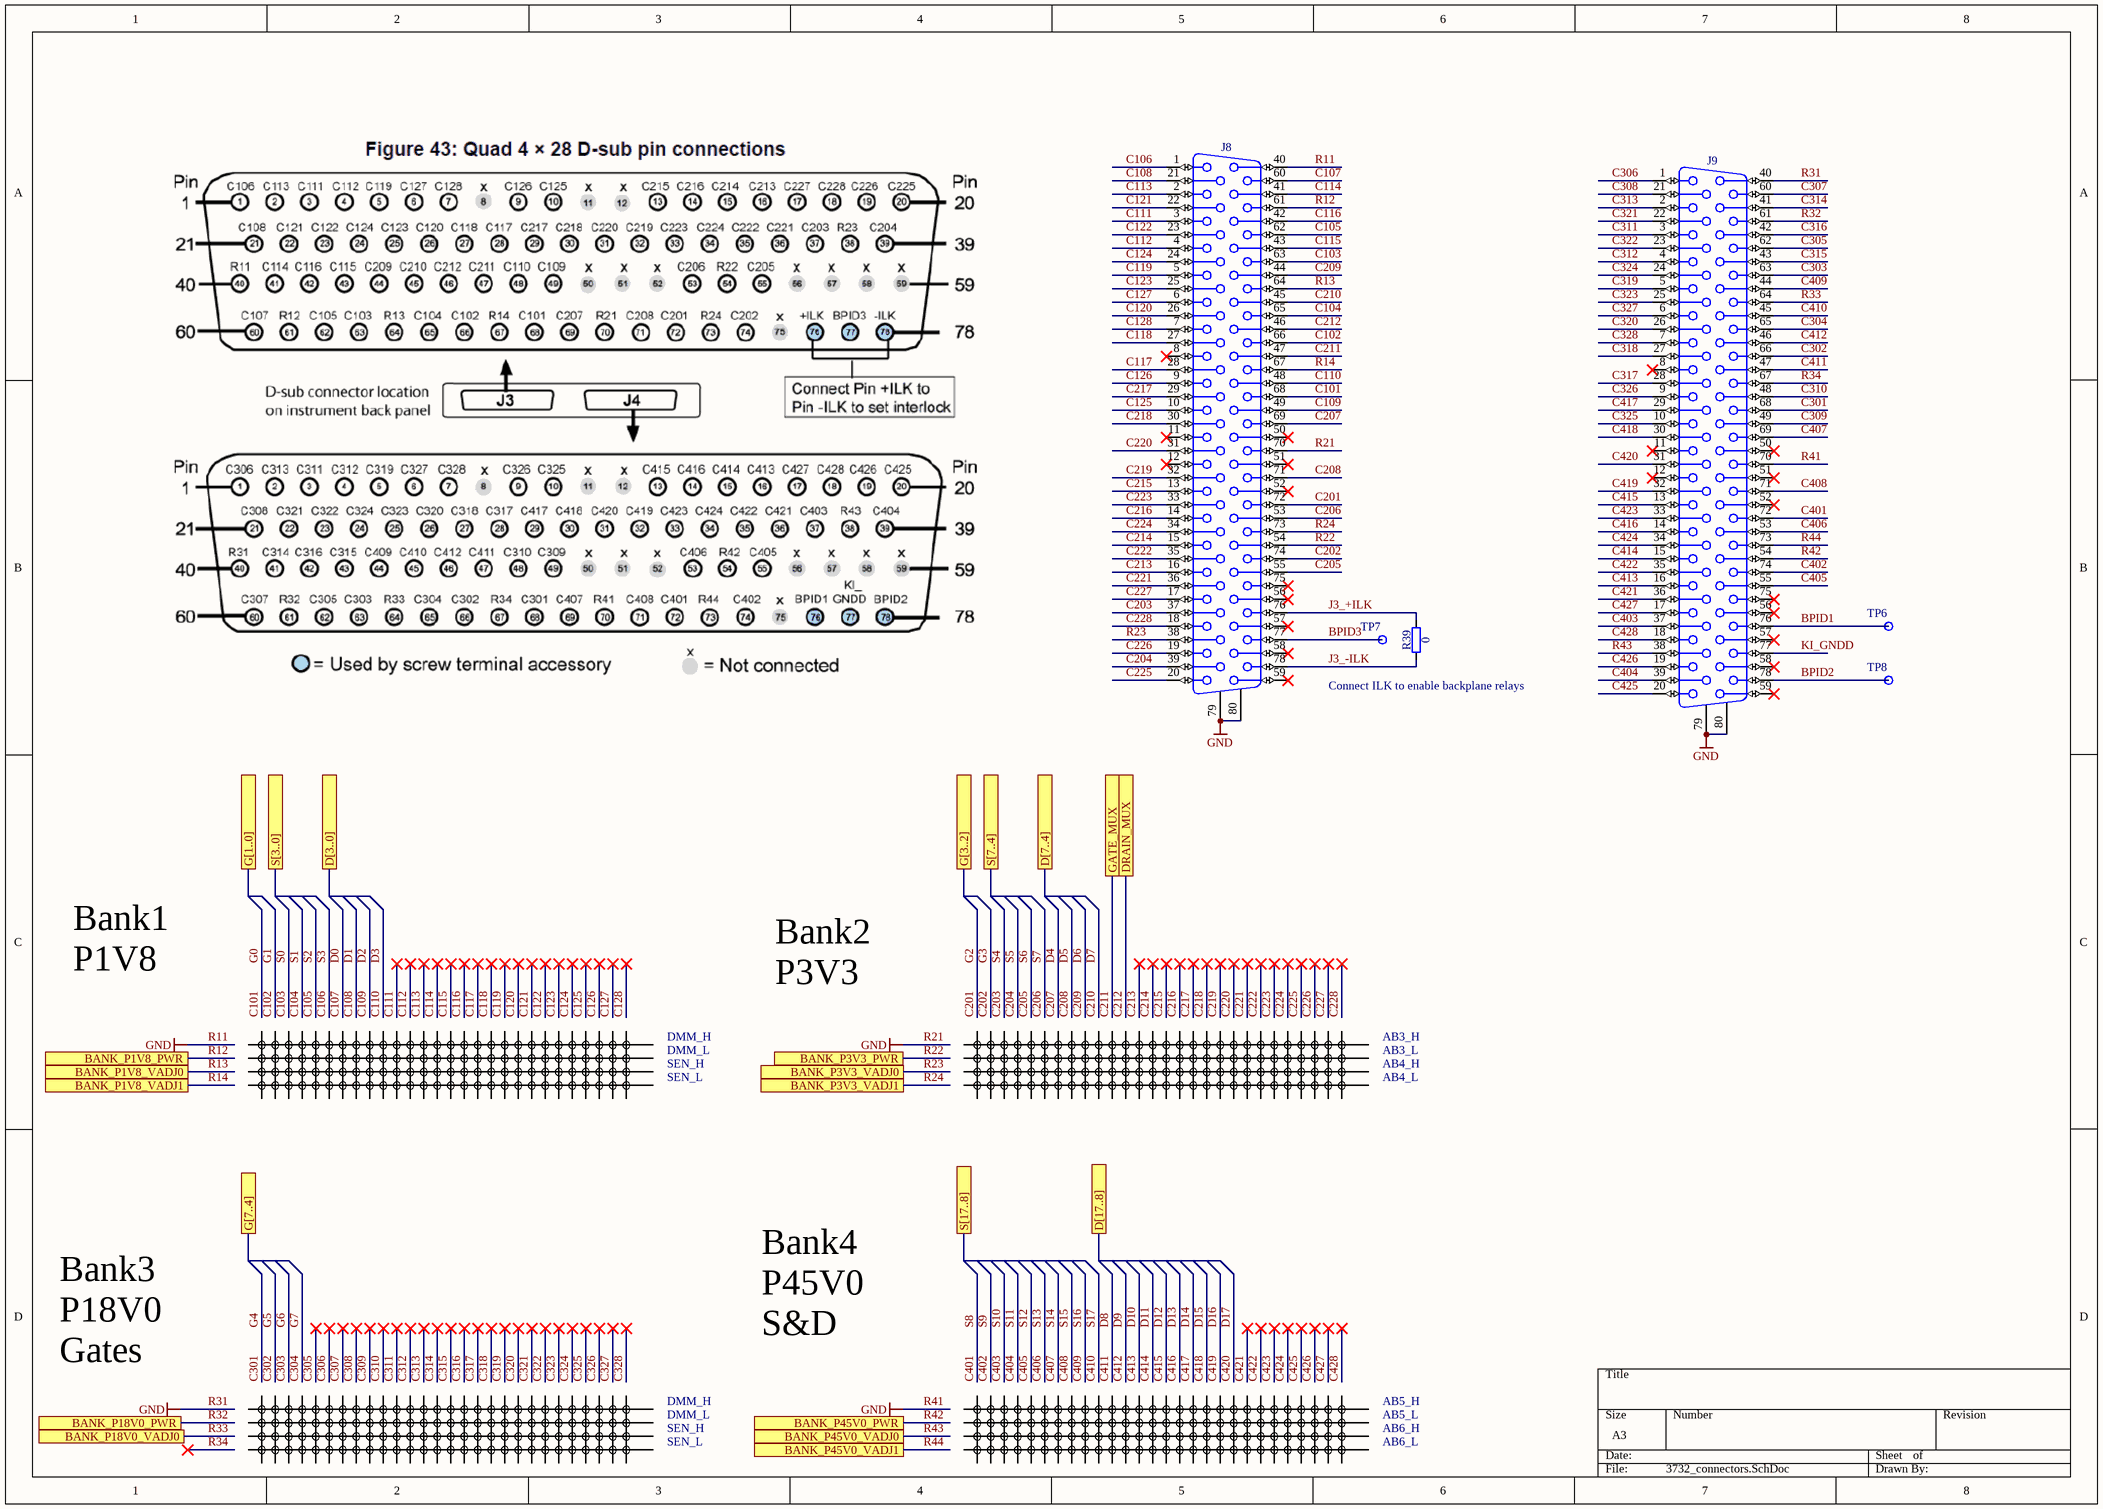
[diagram p1: 3732_connectors.SchDoc]

### Parts
J8  D-Sub 78F  [HARTING_09 56 551 7513]  (value not drawn)
J9  D-Sub 78F  [HARTING_09 56 551 7513]  (value not drawn)
R39  0  [RESC1005X40N]
TP6  Test Point  [TPS127]  (value not drawn)
TP7  Test Point  [TPS127]  (value not drawn)
TP8  Test Point  [TPS127]  (value not drawn)

### Ports
BANK_P1V8_PWR (see top[3B]), BANK_P1V8_VADJ0 (see top[3B], 3723_connectors[3A]), BANK_P1V8_VADJ1 (see top[3B], 3723_connectors[3A]), BANK_P3V3_PWR (see top[5B]), BANK_P3V3_VADJ0 (see top[5B], 3723_connectors[3A]), BANK_P3V3_VADJ1 (see top[5B], 3723_connectors[3A]), BANK_P18V0_PWR (see top[3B]), BANK_P18V0_VADJ0 (see top[3B]), BANK_P45V0_PWR (see top[5B]), BANK_P45V0_VADJ0 (see top[5B]), BANK_P45V0_VADJ1 (see top[5B]), D[3..0] (see top[3B]), D[7..4] (see top[5B]), D[17..8] (see top[5B]), DRAIN_MUX (see top[3B]), G[1..0] (see top[3B]), G[3..2] (see top[5B]), G[7..4] (see top[3B]), GATE_MUX (see top[3B]), S[3..0] (see top[3B]), S[7..4] (see top[5B]), S[17..8] (see top[5B])

### Nets
GND: J8.40 J8.70 J8.79 J8.80 J9.40 J9.70 J9.79 J9.80  [also labelled R11, R21, R31, R41]
R12: J8.61 ; port BANK_P1V8_PWR  [project net P1V8]
R22: J8.54 ; port BANK_P3V3_PWR  [project net P3V3]
R32: J9.61 ; port BANK_P18V0_PWR  [project net P18V0]
R42: J9.54 ; port BANK_P45V0_PWR  [project net P45V0]
BPID1: J9.76 TP6.1
BPID2: J9.78 TP8.1
BPID3: J8.77 TP7.1
C101: J8.68  [also labelled G0]
C102: J8.66  [also labelled G1]
C103: J8.63  [also labelled S0]
C104: J8.65  [also labelled S1]
C105: J8.62  [also labelled S2]
C106: J8.1  [also labelled S3]
C107: J8.60  [also labelled D0]
C108: J8.21  [also labelled D1]
C109: J8.49  [also labelled D2]
C110: J8.48  [also labelled D3]
C111: J8.3
C112: J8.4
C113: J8.2
C114: J8.41
C115: J8.43
C116: J8.42
C117: J8.28
C118: J8.27
C119: J8.5
C120: J8.26
C121: J8.22
C122: J8.23
C123: J8.25
C124: J8.24
C125: J8.10
C126: J8.9
C127: J8.6
C128: J8.7
C201: J8.72  [also labelled G2]
C202: J8.74  [also labelled G3]
C203: J8.37  [also labelled S4]
C204: J8.39  [also labelled S5]
C205: J8.55  [also labelled S6]
C206: J8.53  [also labelled S7]
C207: J8.69  [also labelled D4]
C208: J8.71  [also labelled D5]
C209: J8.44  [also labelled D6]
C210: J8.45  [also labelled D7]
C211: J8.47 ; port GATE_MUX  [project net GATE_MUX]
C212: J8.46 ; port DRAIN_MUX  [project net DRAIN_MUX_P]
C213: J8.16
C214: J8.15
C215: J8.13
C216: J8.14
C217: J8.29
C218: J8.30
C219: J8.32
C220: J8.31
C221: J8.36
C222: J8.35
C223: J8.33
C224: J8.34
C225: J8.20
C226: J8.19
C227: J8.17
C228: J8.18
C301: J9.68  [also labelled G4]
C302: J9.66  [also labelled G5]
C303: J9.63  [also labelled G6]
C304: J9.65  [also labelled G7]
C305: J9.62
C306: J9.1
C307: J9.60
C308: J9.21
C309: J9.49
C310: J9.48
C311: J9.3
C312: J9.4
C313: J9.2
C314: J9.41
C315: J9.43
C316: J9.42
C317: J9.28
C318: J9.27
C319: J9.5
C320: J9.26
C321: J9.22
C322: J9.23
C323: J9.25
C324: J9.24
C325: J9.10
C326: J9.9
C327: J9.6
C328: J9.7
C401: J9.72  [also labelled S8]
C402: J9.74  [also labelled S9]
C403: J9.37  [also labelled S10]
C404: J9.39  [also labelled S11]
C405: J9.55  [also labelled S12]
C406: J9.53  [also labelled S13]
C407: J9.69  [also labelled S14]
C408: J9.71  [also labelled S15]
C409: J9.44  [also labelled S16]
C410: J9.45  [also labelled S17]
C411: J9.47  [also labelled D8]
C412: J9.46  [also labelled D9]
C413: J9.16  [also labelled D10]
C414: J9.15  [also labelled D11]
C415: J9.13  [also labelled D12]
C416: J9.14  [also labelled D13]
C417: J9.29  [also labelled D14]
C418: J9.30  [also labelled D15]
C419: J9.32  [also labelled D16]
C420: J9.31  [also labelled D17]
C421: J9.36
C422: J9.35
C423: J9.33
C424: J9.34
C425: J9.20
C426: J9.19
C427: J9.17
C428: J9.18
J3_+ILK: J8.76 R39.2
J3_-ILK: J8.78 R39.1
KI_GNDD: J9.77
R13: J8.64 ; port BANK_P1V8_VADJ0  [project net BANK_P1V8_VADJ0]
R14: J8.67 ; port BANK_P1V8_VADJ1  [project net BANK_P1V8_VADJ1]
R23: J8.38 ; port BANK_P3V3_VADJ0  [project net BANK_P3V3_VADJ0]
R24: J8.73 ; port BANK_P3V3_VADJ1  [project net BANK_P3V3_VADJ1]
R33: J9.64 ; port BANK_P18V0_VADJ0  [project net BANK_P18V0_VADJ0]
R34: J9.67
R43: J9.38 ; port BANK_P45V0_VADJ0  [project net BANK_P45V0_VADJ0]
R44: J9.73 ; port BANK_P45V0_VADJ1  [project net BANK_P45V0_VADJ1]

Not connected (* = marked no-connect by the designer): J8 8* 11* 12* 50* 51* 52* 56* 57* 58* 59* 75*; J9 8* 11* 12* 50* 51* 52* 56* 57* 58* 59* 75*

### Notes on the sheet
- Connect ILK to enable backplane relays
- Bank1
  P1V8
- DMM_H
- DMM_L
- Bank2
  P3V3
- AB3_H
- AB3_L
- SEN_H
- SEN_L
- AB4_H
- AB4_L
- Bank3
  P18V0
  Gates
- Bank4
  P45V0
  S&D
- AB5_H
- AB5_L
- AB6_H
- AB6_L

### Library data of the parts
J8 J9 = HARTING_09 56 551 7513: Connector D-sub 78 Female; Part Description: High Density Straight Female D-SUB 78 Contacts, with Grounding Board Locks and Female Screw Lock 4-40; PressFit: No; Part Number: HARTING_09 56 551 7513; Component Kind: Standard; Component Type: Standard; Pin Count: 80; Family: D-Sub 78F; Mounted: Yes; Socket: No; SMD: No; Sense: No; Status: None; Manufacturer: HARTING; Manufacturer Part Number: 09 56 551 7513; ComponentHeight: 12.7mm; HelpURL: \\cern.ch\dfs\Applications\Altium\Datasheets\HARTING_09 56 551 7513.pdf; Author: CERN DEM JLC; CreateDate: 15.12.2014; LatestRevisionDate: 15.12.2014
R39 = R0402_0R_JUMPER: Resistor; Part Description: 1A (0.05R Max DC Resistance) Zero Ohm Jumper; Manufacturer: GENERIC; Manufacturer1 Part Number: 232270591001L; PressFit: No; Part Number: R0402_0R_JUMPER; Component Kind: Standard; Component Type: Standard; Pin Count: 2; Value: 0; Status: Not Recommended; Manufacturer Part Number: R0402_0R_JUMPER; Case: 0402; Mounted: Yes; Sense: No; Socket: No; SMD: Yes; Manufacturer1 Example: YAGEO PHYCOMP; Manufacturer1 ComponentHeight: 0.4mm; HelpURL: \\cern.ch\dfs\Applications\Altium\Datasheets\R0402_Phycomp_RC0402.pdf; Author: CERN DEM JLC; CreateDate: 03.12.2007; LatestRevisionDate: 17.10.2012
TP6-TP8 = SMD_PAD_1.27X1.27MM: Part Description: 1.27mm x 1.27mm PCB Copper Area (SMD Test Point); Mounted: No; Part Number: SMD_PAD_1.27X1.27MM; Component Kind: Standard (No BOM); Component Type: Standard (No BOM); Pin Count: 1; Family: Test Point; Socket: No; SMD: No; Sense: No; Status: None; ComponentHeight: 0mm; HelpURL: Undefined; Author: CERN DEM JLC; CreateDate: 12.01.2008; LatestRevisionDate: 12.01.2008; PackageDescription: 1.27mm x 1.27mm PCB Copper Area (SMD Test Point)

## Sheet 3723_connectors.SchDoc
size A3; SheetNumber: 2; SheetTotal: 3
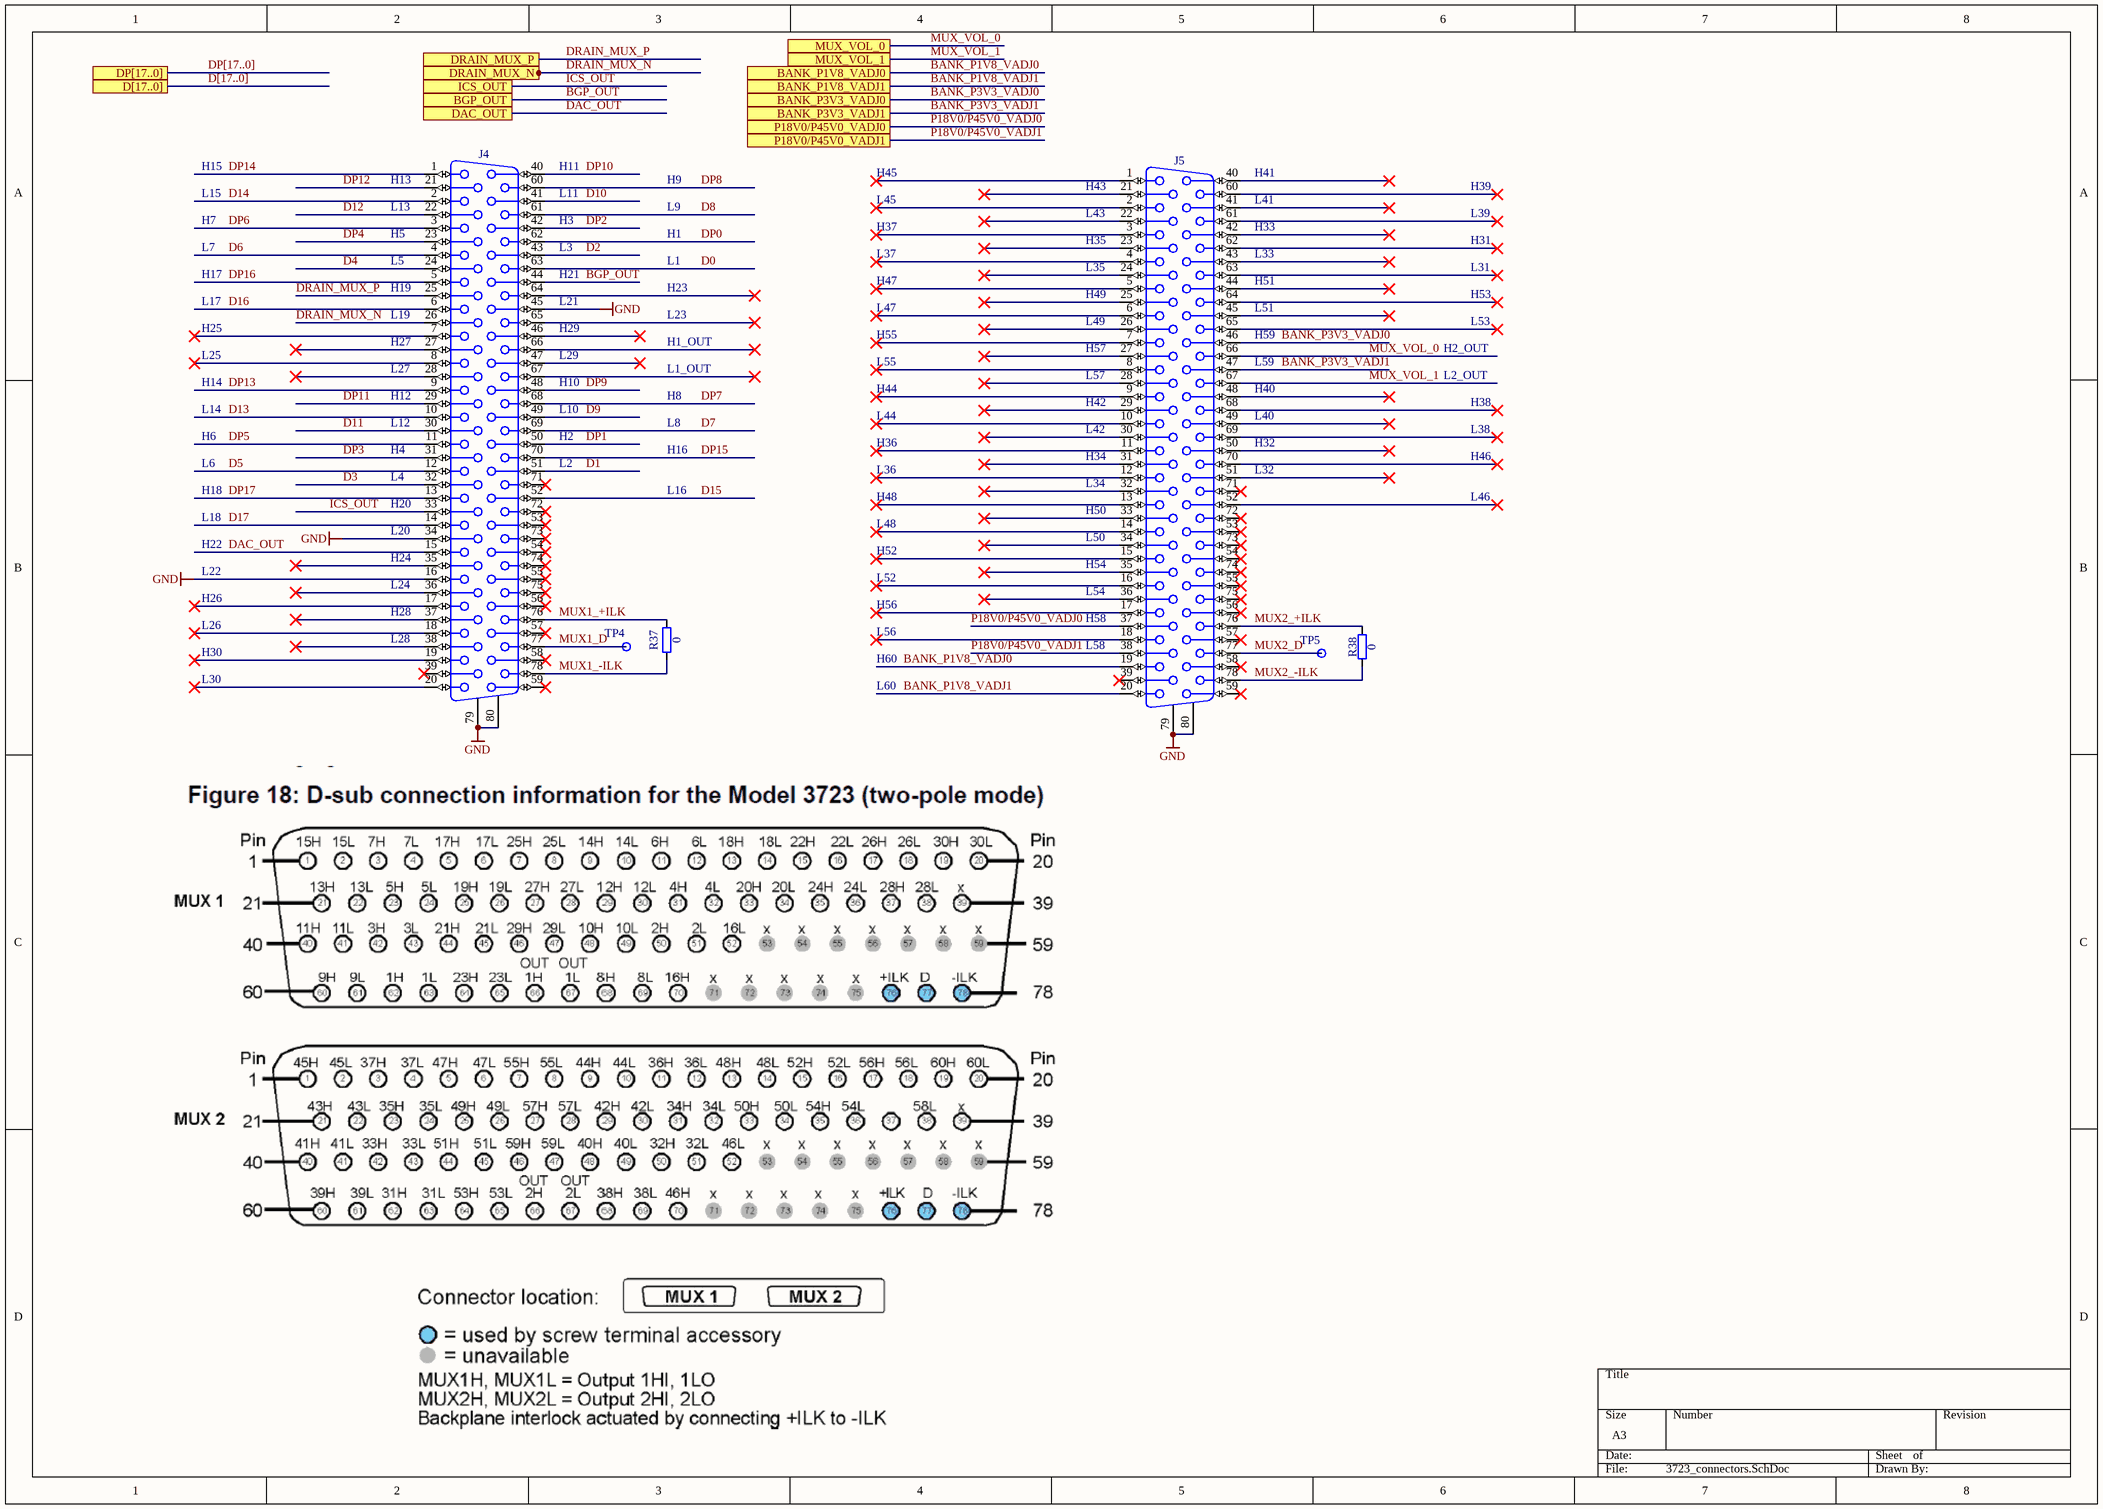
[diagram p2: 3723_connectors.SchDoc]

### Parts
J4  D-Sub 78F  [HARTING_09 56 551 7513]  (value not drawn)
J5  D-Sub 78F  [HARTING_09 56 551 7513]  (value not drawn)
R37  0  [RESC1005X40N]
R38  0  [RESC1005X40N]
TP4  Test Point  [TPS127]  (value not drawn)
TP5  Test Point  [TPS127]  (value not drawn)

### Ports
BANK_P1V8_VADJ0 (see top_PW[5A], 3732_connectors[1C]), BANK_P1V8_VADJ1 (see top_PW[5A], 3732_connectors[1C]), BANK_P3V3_VADJ0 (see top_PW[5A], 3732_connectors[3C]), BANK_P3V3_VADJ1 (see top_PW[5A], 3732_connectors[3C]), BGP_OUT (see top_PW[4A]), D[17..0] (see top_PW[4A]), DAC_OUT (see top_PW[4A]), DP[17..0] (see top_PW[4A]), DRAIN_MUX_N (see top_PW[4A]), DRAIN_MUX_P (see top_PW[4A]), ICS_OUT (see top_PW[4A]), MUX_VOL_0, MUX_VOL_1 (see top_PW[5A]), P18V0/P45V0_VADJ0 (see top_PW[5A]), P18V0/P45V0_VADJ1 (see top_PW[5A])

### Nets
GND: J4.16 J4.34 J4.45 J4.79 J4.80 J5.79 J5.80
BANK_P1V8_VADJ0: J5.19 ; port BANK_P1V8_VADJ0
BANK_P1V8_VADJ1: J5.20 ; port BANK_P1V8_VADJ1
BANK_P3V3_VADJ0: J5.46 ; port BANK_P3V3_VADJ0
BANK_P3V3_VADJ1: J5.47 ; port BANK_P3V3_VADJ1
BGP_OUT: J4.44 ; port BGP_OUT
D0: J4.63
D1: J4.51
D2: J4.43
D3: J4.32
D4: J4.24
D5: J4.12
D6: J4.4
D7: J4.69
D8: J4.61
D9: J4.49
D10: J4.41
D11: J4.30
D12: J4.22
D13: J4.10
D14: J4.2
D15: J4.52
D16: J4.6
D17: J4.14
DAC_OUT: J4.15 ; port DAC_OUT
DP0: J4.62
DP1: J4.50
DP2: J4.42
DP3: J4.31
DP4: J4.23
DP5: J4.11
DP6: J4.3
DP7: J4.68
DP8: J4.60
DP9: J4.48
DP10: J4.40
DP11: J4.29
DP12: J4.21
DP13: J4.9
DP14: J4.1
DP15: J4.70
DP16: J4.5
DP17: J4.13
DRAIN_MUX_N: J4.26 ; port DRAIN_MUX_N
DRAIN_MUX_P: J4.25 ; port DRAIN_MUX_P
ICS_OUT: J4.33 ; port ICS_OUT
MUX1_+ILK: J4.76 R37.2
MUX1_-ILK: J4.78 R37.1
MUX1_D: J4.77 TP4.1
MUX2_+ILK: J5.76 R38.2
MUX2_-ILK: J5.78 R38.1
MUX2_D: J5.77 TP5.1
MUX_VOL_0: J5.66 ; port MUX_VOL_0
MUX_VOL_1: J5.67 ; port MUX_VOL_1
P18V0/P45V0_VADJ0: J5.37 ; port P18V0/P45V0_VADJ0
P18V0/P45V0_VADJ1: J5.38 ; port P18V0/P45V0_VADJ1

Not connected (* = marked no-connect by the designer): J4 7* 8* 17* 18* 19* 20* 27* 28* 35* 36* 37* 38* 39* 46* 47* 53* 54* 55* 56* 57* 58* 59* 64* 65* 66* 67* 71* 72* 73* 74* 75*; J5 1* 2* 3* 4* 5* 6* 7* 8* 9* 10* 11* 12* 13* 14* 15* 16* 17* 18* 21* 22* 23* 24* 25* 26* 27* 28* 29* 30* 31* 32* 33* 34* 35* 36* 39* 40* 41* 42* 43* 44* 45* 48* 49* 50* 51* 52* 53* 54* 55* 56* 57* 58* 59* 60* 61* 62* 63* 64* 65* 68* 69* 70* 71* 72* 73* 74* 75*

### Buses and harness runs
bus D[17..0] = port D[17..0]
bus DP[17..0] = port DP[17..0]

### Notes on the sheet
- H15
- (near J4) H13
- (near J4) H11
- H9
- H45
- (near J5) H41
- L15
- H7
- (near J4) L13
- (near J4) H5
- (near J4) L11
- (near J4) H3
- L9
- H1
- H37
- L45
- (near J5) H35
- (near J5) H43
- (near J5) L43
- (near J5) H33
- (near J5) L41
- H31
- H39
- L39
- L17
- L7
- H17
- (near J4) L19
- (near J4) L5
- (near J4) H19
- (near J4) L21
- (near J4) L3
- (near J4) H21
- L23
- L1
- H23
- H47
- L37
- L47
- (near J5) H49
- (near J5) L35
- (near J5) H51
- (near J5) L33
- (near J5) L51
- H53
- L31
- L25
- H25
- (near J4) L27
- (near J4) H27
- (near J4) L29
- (near J4) H29
- H1_OUT
- L1_OUT
- H55
- L55
- (near J5) H57
- (near J5) L49
- (near J5) L57
- (near J5) H59
- (near J5) L59
- H2_OUT
- L2_OUT
- L53
- L14
- H6
- H14
- (near J4) L12
- (near J4) H4
- (near J4) H12
- (near J4) L10
- (near J4) H2
- (near J4) H10
- L8
- H8
- H16
- H36
- H44
- L44
- (near J5) H42
- (near J5) L42
- (near J5) H32
- (near J5) H40
- (near J5) L40
- H38
- L38
- L6
- H18
- (near J4) L4
- (near J4) H20
- (near J4) L2
- L16
- H48
- L36
- (near J5) H34
- (near J5) H50
- (near J5) L34
- (near J5) L32
- H46
- L46
- L18
- L22
- H22
- (near J4) L20
- (near J4) L24
- (near J4) H24
- H52
- L48
- L52
- (near J5) H54
- (near J5) L50
- L26
- H26
- (near J4) L28
- (near J4) H28
- H56
- L56
- (near J5) H58
- (near J5) L54
- (near J5) L58
- L30
- H30
- H60
- L60

### Library data of the parts
J4 J5 = HARTING_09 56 551 7513: as J8 on sheet 3732_connectors; Part Number: HARTING_09 56 551 7513; Component Kind: Standard; Component Type: Standard; Pin Count: 80; Family: D-Sub 78F; Mounted: Yes; Socket: No; SMD: No; Sense: No; Status: None; Manufacturer: HARTING; Manufacturer Part Number: 09 56 551 7513; ComponentHeight: 12.7mm; HelpURL: \\cern.ch\dfs\Applications\Altium\Datasheets\HARTING_09 56 551 7513.pdf; Author: CERN DEM JLC; CreateDate: 15.12.2014; LatestRevisionDate: 15.12.2014
R37 R38 = R0402_0R_JUMPER: as R39 on sheet 3732_connectors; Part Number: R0402_0R_JUMPER; Component Kind: Standard; Component Type: Standard; Pin Count: 2; Value: 0; Status: Not Recommended; Manufacturer Part Number: R0402_0R_JUMPER; Case: 0402; Mounted: Yes; Sense: No; Socket: No; SMD: Yes; Manufacturer1 Example: YAGEO PHYCOMP; Manufacturer1 ComponentHeight: 0.4mm; HelpURL: \\cern.ch\dfs\Applications\Altium\Datasheets\R0402_Phycomp_RC0402.pdf; Author: CERN DEM JLC; CreateDate: 03.12.2007; LatestRevisionDate: 17.10.2012
TP4 TP5 = SMD_PAD_1.27X1.27MM: as TP6 on sheet 3732_connectors; Part Number: SMD_PAD_1.27X1.27MM; Component Kind: Standard (No BOM); Component Type: Standard (No BOM); Pin Count: 1; Family: Test Point; Socket: No; SMD: No; Sense: No; Status: None; ComponentHeight: 0mm; HelpURL: Undefined; Author: CERN DEM JLC; CreateDate: 12.01.2008; LatestRevisionDate: 12.01.2008; PackageDescription: 1.27mm x 1.27mm PCB Copper Area (SMD Test Point)

## Nets that join several sheets
GND: top (46 pins), 3732_connectors (8 pins), 3723_connectors (7 pins)
P1V8: top (9 pins), 3732_connectors (J8.61)
P3V3: top (9 pins), 3732_connectors (J8.54)
P18V0: top (J15.3), 3732_connectors (J9.61)
P45V0: top (J6.17 J6.19 J15.2), 3732_connectors (J9.54)
BANK_P1V8_VADJ0: 3732_connectors (J8.64), 3723_connectors (J5.19)
BANK_P1V8_VADJ1: 3732_connectors (J8.67), 3723_connectors (J5.20)
BANK_P3V3_VADJ0: 3732_connectors (J8.38), 3723_connectors (J5.46)
BANK_P3V3_VADJ1: 3732_connectors (J8.73), 3723_connectors (J5.47)
BANK_P18V0_VADJ0: top (RL1.1), 3732_connectors (J9.64)
BANK_P45V0_VADJ0: top (RL1.3 RL1.4), 3732_connectors (J9.38)
BANK_P45V0_VADJ1: top (RL1.2), 3732_connectors (J9.73)
BGP_OUT: top (J2.16), 3723_connectors (J4.44)
D0: top (J3.18 R1.2), 3723_connectors (J4.63)
D1: top (J3.20 R2.2), 3723_connectors (J4.51)
D2: top (J3.2 R3.2), 3723_connectors (J4.43)
D3: top (J3.4 R4.2), 3723_connectors (J4.32)
D4: top (J3.6 R5.2), 3723_connectors (J4.24)
D5: top (J3.8 R6.2), 3723_connectors (J4.12)
D6: top (J6.12 R7.2), 3723_connectors (J4.4)
D7: top (J6.14 R8.2), 3723_connectors (J4.69)
D8: top (J6.11 R9.2), 3723_connectors (J4.61)
D9: top (J6.13 R10.2), 3723_connectors (J4.49)
D10: top (J3.9 R11.2), 3723_connectors (J4.41)
D11: top (J3.7 R12.2), 3723_connectors (J4.30)
D12: top (J3.5 R13.2), 3723_connectors (J4.22)
D13: top (J3.3 R14.2), 3723_connectors (J4.10)
D14: top (J3.1 R15.2), 3723_connectors (J4.2)
D15: top (J6.16 R16.2), 3723_connectors (J4.52)
D16: top (J6.18 R17.2), 3723_connectors (J4.6)
D17: top (J6.20 R18.2), 3723_connectors (J4.14)
DAC_OUT: top (J2.15), 3723_connectors (J4.15)
DP0: top (R1.1), 3723_connectors (J4.62)
DP1: top (R2.1), 3723_connectors (J4.50)
DP2: top (R3.1), 3723_connectors (J4.42)
DP3: top (R4.1), 3723_connectors (J4.31)
DP4: top (R5.1), 3723_connectors (J4.23)
DP5: top (R6.1), 3723_connectors (J4.11)
DP6: top (R7.1), 3723_connectors (J4.3)
DP7: top (R8.1), 3723_connectors (J4.68)
DP8: top (R9.1), 3723_connectors (J4.60)
DP9: top (R10.1), 3723_connectors (J4.48)
DP10: top (R11.1), 3723_connectors (J4.40)
DP11: top (R12.1), 3723_connectors (J4.29)
DP12: top (R13.1), 3723_connectors (J4.21)
DP13: top (R14.1), 3723_connectors (J4.9)
DP14: top (R15.1), 3723_connectors (J4.1)
DP15: top (R16.1), 3723_connectors (J4.70)
DP16: top (R17.1), 3723_connectors (J4.5)
DP17: top (R18.1), 3723_connectors (J4.13)
DRAIN_MUX_N: top (J2.20 R20.2), 3723_connectors (J4.26)
DRAIN_MUX_P: top (R20.1), 3732_connectors (J8.46), 3723_connectors (J4.25)
GATE_MUX: top (J2.18), 3732_connectors (J8.47)
ICS_OUT: top (J1.1), 3723_connectors (J4.33)
MUX_VOL_0: top (RL2.8), 3723_connectors (J5.66)
MUX_VOL_1: top (RL2.9), 3723_connectors (J5.67)
P18V0/P45V0_VADJ0: top (RL1.8), 3723_connectors (J5.37)
P18V0/P45V0_VADJ1: top (RL1.9), 3723_connectors (J5.38)

## Assembly variants
default: not fitted R38 R39